# Altium schematic sheet Coil_Driver_Rev_A.SchDoc
size B; SheetNumber: 1; SheetTotal: 1; PageSetup: Record=PageOptions|CenterHorizontal=True|CenterVertical=True|PrintScale=0.95|XCorrection=1.00|YCorrection=1.00|PrintKind=1|BorderSize=5000000|LeftOffset=0|BottomOffset=0|Orientation=2|PaperLength=1000|PaperWidth=1000|Scale=100|PaperSource=7|PrintQuality=-4|MediaType=1|DitherType=10|PaperKind=Letter|PrintScaleMode=1
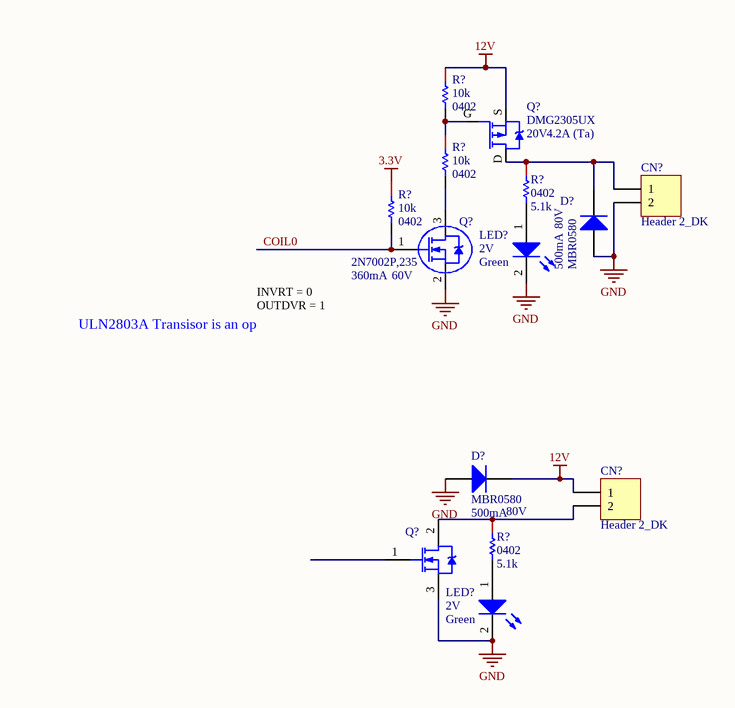
[diagram p0: Coil_Driver_Rev_A.SchDoc]

## Parts
(Parts that share a designator on the sheet are numbered #1, #2 ... from top to bottom, then left to right.)
CN?#1  Header 2_DK  [HDR1X2]
CN?#2  Header 2_DK  [HDR1X2]
D?#1  MBR0580  Current - Average Rectified (Io): 500mA  Voltage - DC Reverse (Vr) (Max): 80V  [SOD123]
D?#2  MBR0580  Current - Average Rectified (Io): 500mA  Voltage - DC Reverse (Vr) (Max): 80V  [SOD123]
LED?#1  Voltage - Forward (Vf) (Typ): 2V  Color: Green  [SM-LED-0603]  (hidden comment: LTST-C191KGKT)
LED?#2  Voltage - Forward (Vf) (Typ): 2V  Color: Green  [SM-LED-0603]  (hidden comment: LTST-C191KGKT)
Q?#1  DMG2305UX  Current - Continuous Drain (Id) @ 25°C: 4.2A (Ta)  Drain to Source Voltage (Vdss): 20V  [DMG2305UX-7]
Q?#2  2N7002P,235  Continuous Drain Current (ID): 360mA  Drain to Source Voltage (Vdss): 60V  [SOT23-3L]
Q?#3  IPD036N04L  [PG-TO252-3]  (value not drawn)
R?#1  Resistance: 10k  Case Code (Imperial): 0402  [RESC0402(1005)_L]  (hidden comment: RES 10K OHM 0.1% 1/16W 0402)
R?#2  Resistance: 10k  Case Code (Imperial): 0402  [RESC0402(1005)_L]  (hidden comment: RES 10K OHM 0.1% 1/16W 0402)
R?#3  Package (Imperial): 0402  [RESC0402(1005)_L]  (hidden comment: 5.1K)
R?#4  Resistance: 10k  Case Code (Imperial): 0402  [RESC0402(1005)_L]  (hidden comment: RES 10K OHM 0.1% 1/16W 0402)
R?#5  Package (Imperial): 0402  [RESC0402(1005)_L]  (hidden comment: 5.1K)

## Nets
3.3V: R?#4.1
12V: CN?#2.1 D?#2.2(K) Q?#1.S R?#1.1
GND: CN?#1.2 D?#1.1(A) D?#2.1(A) LED?#1.2(K) LED?#2.2(K) Q?#2.2(S) Q?#3.3(S)
COIL0: Q?#2.1(G) R?#4.2
NetCN?#1_1: CN?#1.1 D?#1.2(K) Q?#1.D R?#3.1
NetCN?#2_2: CN?#2.2 Q?#3.2(D) R?#5.1
NetLED?#1_1: LED?#1.1(A) R?#3.2
NetLED?#2_1: LED?#2.1(A) R?#5.2
NetQ?#1_G: Q?#1.G R?#1.2 R?#2.1
NetQ?#2_3: Q?#2.3(D) R?#2.2

Not connected (* = marked no-connect by the designer): Q?#3 1(G)

## Notes on the sheet
- ULN2803A Transisor is an option too
- INVRT = 0
  OUTDVR = 1
- Title
- By:
- Date:
- Number:
- Time:
- Revision:
- Sheet
- of
- OLogic, Inc.
- 3350 Scott Blvd. Bldg 47
- Santa Clara, CA
- 95054 USA
- File:
- (650) 996-1490

## Library data of the parts
CN?#1 CN?#2 = CMP-001-0280-01: Header, 2-Pin; Manufacturer Part Number: 826936-2; Manufacturer: TE Connectivity AMP Connectors; Number of Positions: 2; Connector Type: Header, Unshrouded, Breakaway; Number of Positions Loaded: All; Features: -; Packaging: Bulk; Component Name: Header 2_DK; Color: Green; Stock 1: 32894; ComponentLink1Description: http://www.te.com/commerce/DocumentDelivery/DDEController?Action=srchrtrv&DocNm=826629&DocType=Customer+Drawing&DocLang=English; RoHS: RoHS Compliant; Contact Type: Male Pin; Fastening Type: -; Number of Rows: 1; Designator: Header 2_DK; Termination: Solder; Part Status: Active; ComponentLink1URL: http://www.te.com/commerce/DocumentDelivery/DDEController?Action=srchrtrv&DocNm=826629&DocType=Customer+Drawing&DocLang=English; Contact Finish Thickness: 78.7µin (2.00µm); Pricing 1: 1=0.23, 10=0.211, 25=0.18, 50=0.1576, 100=0.1463, 250=0.12944, 500=0.1238, 1000=0.10129, 2500=0.09284 (USD); Row Spacing: -; Pin Count: 2; Mounting Type: Through Hole; Contact Finish: Tin
D?#1 D?#2 = CMP-001-0093-01: Schottky Barrier Rectifier 0.5A 80V; Manufacturer: Micro Commercial Co; Manufacturer Part Number: MBR0580-TP; Capacitance @ Vr, F: 30pF @ 4V, 1MHz; Voltage - Forward (Vf) (Max) @ If: 800mV @ 500mA; Speed: Fast Recovery =< 500ns, > 200mA (Io); Current - Reverse Leakage @ Vr: 200µA @ 80V; RoHS: RoHS Compliant; Mounting Type: Surface Mount; Component Name: MBR0580; Pin Count: 2; Designator: MBR0580; Pricing 1: 1=0.39, 10=0.278, 25=0.2164, 100=0.1638, 250=0.1158, 500=0.0927, 1000=0.0711 (USD); Reverse Recovery Time (trr): -; Supplier Device Package: SOD-123; ComponentLink1URL: http://www.mccsemi.com/up_pdf/MBR0520~MBR0580(SOD123).pdf; Diode Type: Schottky; Operating Temperature - Junction: -55°C ~ 150°C; Stock 1: 19317; ComponentLink1Description: http://www.mccsemi.com/up_pdf/MBR0520~MBR0580(SOD123).pdf; Packaging: Cut Tape (CT); Package / Case: SOD-123
LED?#1 LED?#2 = CMP-001-0086-07: LED GREEN CLEAR THIN 0603 SMD; Manufacturer: Lite-On Inc; Viewing Angle: 130°; Wavelength - Peak: 574nm; Wavelength - Dominant: 571nm; Current - Test: 20mA; Millicandela Rating: 35mcd; Lens Style/Size: Rectangle with Flat Top, 1.1mm x 0.8mm; Pin Count: 2; Packaging: Cut Tape (CT); Height: 0.55mm; Size / Dimension: 1.60mm L x 0.80mm W; Mounting Type: Surface Mount; ClassName: *; RoHS: RoHS Compliant; Pricing 1: 1=0.3, 10=0.238, 100=0.1296, 250=0.0864, 500=0.07344, 1000=0.05616, 2500=0.05076 (USD); Lens Type: Clear; Manufacturer Part Number: LTST-C191KGKT; Stock 1: 84829; Package / Case: 0603 (1608 Metric)
Q?#1 = CMP-012-0038-02: MOSFET P-CH 20V 4.2A SOT23; Manufacturer: Diodes Incorporated; Input Capacitance (Ciss) @ Vds: 808pF @ 15V; FET Type: MOSFET P-Channel, Metal Oxide; Power - Max: 1.4W; FET Feature: Standard; Rds On (Max) @ Id, Vgs: 52 mOhm @ 4.2A, 4.5V; Gate Charge (Qg) @ Vgs: 10.2nC @ 4.5V; Vgs(th) (Max) @ Id: 900mV @ 250µA; Manufacturer Part Number: DMG2305UX-7; ComponentLink1URL: http://www.diodes.com/_files/datasheets/DMG2305UX.pdf; ComponentLink1Description: http://www.diodes.com/_files/datasheets/DMG2305UX.pdf; Pricing 1: 1=0.38, 10=0.311, 100=0.1649, 500=0.10846, 1000=0.0739 (USD); Designator: DMG2305UX; Package / Case: TO-236-3, SC-59, SOT-23-3; Supplier Device Package: SOT-23; Component Name: DMG2305UX; Creator: osman; RoHS: RoHS Compliant; Packaging: Cut Tape (CT); Operating Temperature: -55°C ~ 150°C (TJ); Pin Count: 3; Mounting Type: Surface Mount; Stock 1: 78669
Q?#2 = CMP-012-0002-01: MOSFET N-CH 60V 0.36A SOT-23; Manufacturer: NXP Semiconductors; FET Type: N-Channel; Drain to Source Resistance: 1.6R; Power Dissipation (Max): 350mW (Ta); Gate to Source Voltage (Vgs): 20V; Vgs (Max): ±20V; Turn-Off Delay Time: 10ns; Input Capacitance: 50pF; Current - Continuous Drain (Id) @ 25°C: 360mA (Ta); Max Power Dissipation: 350mW; Drive Voltage (Max Rds On,  Min Rds On): 10V; Rise Time: 4ns; Fall Time: 5ns; Vgs(th) (Max) @ Id: 2.4V @ 250µA; Number of Elements: 1; Power Dissipation: 420mW; Rds On (Max) @ Id, Vgs: 1.6 Ohm @ 500mA, 10V; Turn-On Delay Time: 3ns; ComponentLink7Description: https://datasheet.ciiva.com/15216/getdatasheetpartid-496132-15216636.pdf; ComponentLink2Description: https://datasheet.ciiva.com/4439/2n7002p-99415-4439248.pdf; Contact Plating: Tin; ComponentLink3URL: https://datasheet.ciiva.com/6371/2n7002p-6371141.pdf; Stock 1: 109268; FET Feature: -; Case/Package: SOT; RoHS: RoHS Compliant; ComponentLink2URL: https://datasheet.ciiva.com/4439/2n7002p-99415-4439248.pdf; ComponentLink8URL: https://datasheet.ciiva.com/46633/discretesemiconductors-46633181.pdf; Number of Pins: 3; ComponentLink1Description: http://assets.nexperia.com/documents/data-sheet/2N7002P.pdf; Pricing 1: 1=0.14, 10=0.128, 100=0.07, 500=0.043, 1000=0.0294 (USD); Mounting Type: Surface Mount; Rds On Max: 1.6R; Package Quantity: 10000; Pricing 2: 1=0.16, 10=0.148, 100=0.0969, 500=0.04738, 1000=0.03231 (USD); Lead Free: Lead Free; ComponentLink4Description: https://datasheet.ciiva.com/49067/getdatasheetpartid-765733-49067862.pdf; ComponentLink4URL: https://datasheet.ciiva.com/49067/getdatasheetpartid-765733-49067862.pdf; Packaging: Tape and Reel; Max Dual Supply Voltage: 60V; Part Status: Active; ComponentLink1URL: http://assets.nexperia.com/documents/data-sheet/2N7002P.pdf; ComponentLink7URL: https://datasheet.ciiva.com/15216/getdatasheetpartid-496132-15216636.pdf; Component Name: 2N7002P,235; Pin Count: 3; Operating Temperature: -55°C ~ 150°C (TJ); Stock 2: 177811; ComponentLink3Description: https://datasheet.ciiva.com/6371/2n7002p-6371141.pdf; ComponentLink6Description: https://datasheet.ciiva.com/26921/getdatasheetpartid-765733-26921227.pdf; ComponentLink5Description: https://datasheet.ciiva.com/11168/2n7002p-11168552.pdf; ComponentLink9URL: https://assets.nexperia.com/documents/data-sheet/2N7002P.pdf; ComponentLink8Description: https://datasheet.ciiva.com/46633/discretesemiconductors-46633181.pdf; ComponentLink6URL: https://datasheet.ciiva.com/26921/getdatasheetpartid-765733-26921227.pdf; Package / Case: TO-236-3, SC-59, SOT-23-3; Min Operating Temperature: -55°C; Radiation Hardening: No; ComponentLink5URL: https://datasheet.ciiva.com/11168/2n7002p-11168552.pdf; Manufacturer Part Number: 2N7002P,235; Drain to Source Breakdown Voltage: 60V; Supplier Device Package: TO-236AB (SOT23); Designator: 2N7002P,235; Max Operating Temperature: 150°C; ComponentLink9Description: https://assets.nexperia.com/documents/data-sheet/2N7002P.pdf; Technology: MOSFET (Metal Oxide)
Q?#3 = CMP-012-0060-01: IPD036N04L N-Channel MOSFET; Manufacturer: Infineon Technologies; Manufacturer Part Number: IPD036N04L G; FET Feature: Logic Level Gate; Gate Charge (Qg) @ Vgs: 78nC @ 10V; FET Type: MOSFET N-Channel, Metal Oxide; Rds On (Max) @ Id, Vgs: 3.6 mOhm @ 90A, 10V; Current - Continuous Drain (Id) @ 25°C: 90A; Power - Max: 94W; Drain to Source Voltage (Vdss): 40V; Input Capacitance (Ciss) @ Vds: 6300pF @ 20V; Vgs(th) (Max) @ Id: 2V @ 45µA; Component Name: IPD036N04L; ComponentLink1URL: http://www.infineon.com/dgdl/IPD036N04L_rev1.0.pdf?folderId=db3a3043163797a6011643468e7505a4&fileId=db3a3043163797a6011643476a6505a5; ComponentLink1Description: http://www.infineon.com/dgdl/IPD036N04L_rev1.0.pdf?folderId=db3a3043163797a6011643468e7505a4&fileId=db3a3043163797a6011643476a6505a5; Supplier Device Package: PG-TO252-3; Pricing 1: 1=1.43, 10=1.283, 25=1.132, 100=1.0187, 250=0.88664, 500=0.79232, 1000=0.61034 (USD); Designator: IPD036N04L; Packaging: Digi-Reel®; Pin Count: 3; Package / Case: TO-252-3, DPak (2 Leads + Tab), SC-63; Mounting Type: Surface Mount; RoHS: RoHS Compliant; Stock 1: 115
R?#1 R?#2 R?#4 = CMP-001-0950-02: 10 kOhms ±0.1% 0.063W, 1/16W Chip Resistor 0402 (1005 Metric) Automotive AEC-Q200 Thin Film; Temperature Coefficient: 25ppm/°C; Max Power Dissipation: 63mW; Length: 0.039inch; Max Operating Temperature: 155°C; Min Operating Temperature: -55°C; Case/Package: 0402; Packaging: Tape and Reel; Tolerance: 0.1%; Width: 0.02inch; Contact Plating: Tin,Matte; Height: 0.016inch; Composition: Thin Film; Case Code (Metric): 1005; Package Quantity: 10000; Mount: Surface Mount; Radiation Hardening: No; Number of Terminations: 2; Features: Moisture Resistant
R?#3 R?#5 = CMP-007-0525-15: RES SMD 5.1K OHM 1% 1/10W 0402; Package (Metric): 1005; Max Power Dissipation: 100mW; Voltage Rating (DC): 50V; Power: 63mW; Temperature Coefficient: 100ppm/°C; Resistance: 5.1k; Termination: SMD/SMT; Lead Free: Lead Free; Mount: Surface Mount; Length: 1mm; Width: 500µm; Min Operating Temperature: -55°C; Contact Plating: Tin; Weight: 2.8E-05oz; Voltage Rating: 50V; Height: 350µm; Depth: 0.5mm; Military Standard: Not; Composition: Thick Film; Number of Terminations: 2; Packaging: Tape and Reel; Power Rating: 100mW; Tolerance: 1%; Package Quantity: 10000; Max Operating Temperature: 155°C; REACH SVHC: No SVHC